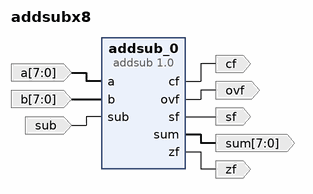
[diagram p0: block diagram of the top level]
# Vivado block design addsubx8, xc7a100tfgg484-1, Vivado 2017.4
create_bd_design addsubx8

create_bd_port -dir I -from 7 -to 0 a
create_bd_port -dir I -from 7 -to 0 b
create_bd_port -dir I sub
create_bd_port -dir O -from 7 -to 0 sum
create_bd_port -dir O cf
create_bd_port -dir O ovf
create_bd_port -dir O sf
create_bd_port -dir O zf

create_bd_cell -type ip -vlnv CSE:CSE:addsub:1.0 addsub_0

# ---- connections ----

connect_bd_net [get_bd_ports a] [get_bd_pins addsub_0/a]
connect_bd_net [get_bd_ports b] [get_bd_pins addsub_0/b]
connect_bd_net [get_bd_ports sub] [get_bd_pins addsub_0/sub]
connect_bd_net [get_bd_pins addsub_0/sum] [get_bd_ports sum]
connect_bd_net [get_bd_pins addsub_0/cf] [get_bd_ports cf]
connect_bd_net [get_bd_pins addsub_0/ovf] [get_bd_ports ovf]
connect_bd_net [get_bd_pins addsub_0/sf] [get_bd_ports sf]
connect_bd_net [get_bd_pins addsub_0/zf] [get_bd_ports zf]

validate_bd_design
save_bd_design
